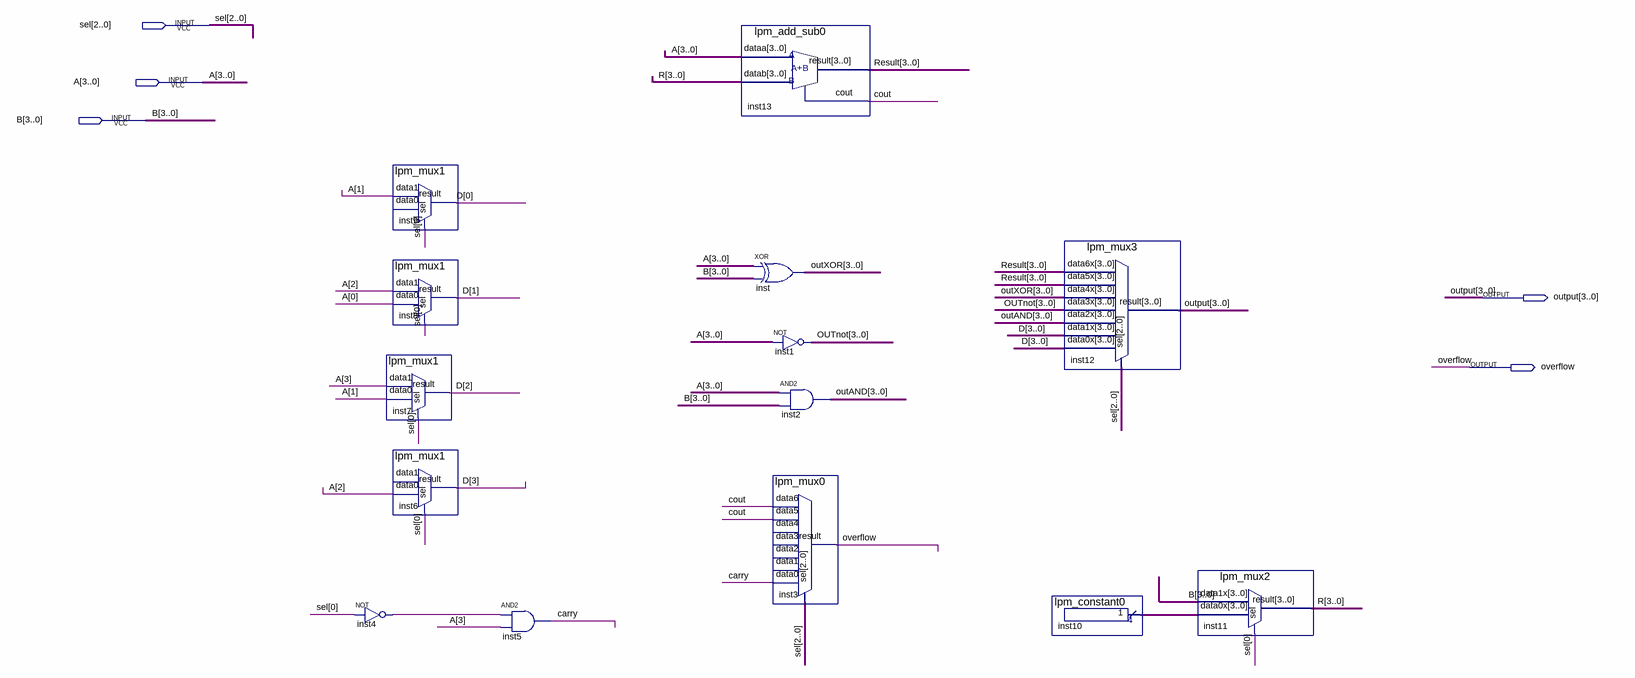
[diagram p0: schematic sheet]
// Quartus schematic ALU_insideBus.bdf as structural Verilog: 14 symbols, 5 pins
module ALU_insideBus (
  input  [2:0] sel,
  input  [3:0] A,
  input  [3:0] B,
  output [3:0] \output ,
  output overflow
);

  wire carry, cout, inst4_out;
  wire [3:0] D, inst10_result, outAND, OUTnot, outXOR, R, Result;

  not inst4 (inst4_out, sel[0]);
  lpm_mux1 inst9 (.data1(A[1]), .sel(sel[0]), .result(D[0]));  // open: data0
  lpm_mux1 inst8 (.data1(A[2]), .data0(A[0]), .sel(sel[0]), .result(D[1]));
  lpm_mux1 inst7 (.data1(A[3]), .data0(A[1]), .sel(sel[0]), .result(D[2]));
  lpm_mux1 inst6 (.data0(A[2]), .sel(sel[0]), .result(D[3]));  // open: data1
  and inst5 (carry, inst4_out, A[3]);
  lpm_add_sub0 inst13 (.dataa(A), .datab(R), .result(Result), .cout(cout));
  assign outXOR = A ^ B;  // XOR inst, 4 bits wide
  assign OUTnot = ~A;  // NOT inst1, 4 bits wide
  lpm_mux0 inst3 (
    .data6(cout), .data5(cout), .data0(carry), .sel(sel), .result(overflow));  // open: data4, data3, data2, data1
  assign outAND = A & B;  // AND2 inst2, 4 bits wide
  lpm_mux3 inst12 (
    .data6x(Result), .data5x(Result), .data4x(outXOR), .data3x(OUTnot), .data2x(outAND), .data1x(D),
    .data0x(D), .sel(sel), .result(\output ));
  lpm_constant0 inst10 (.result(inst10_result));
  lpm_mux2 inst11 (.data1x(B), .data0x(inst10_result), .sel(sel[0]), .result(R));
endmodule
